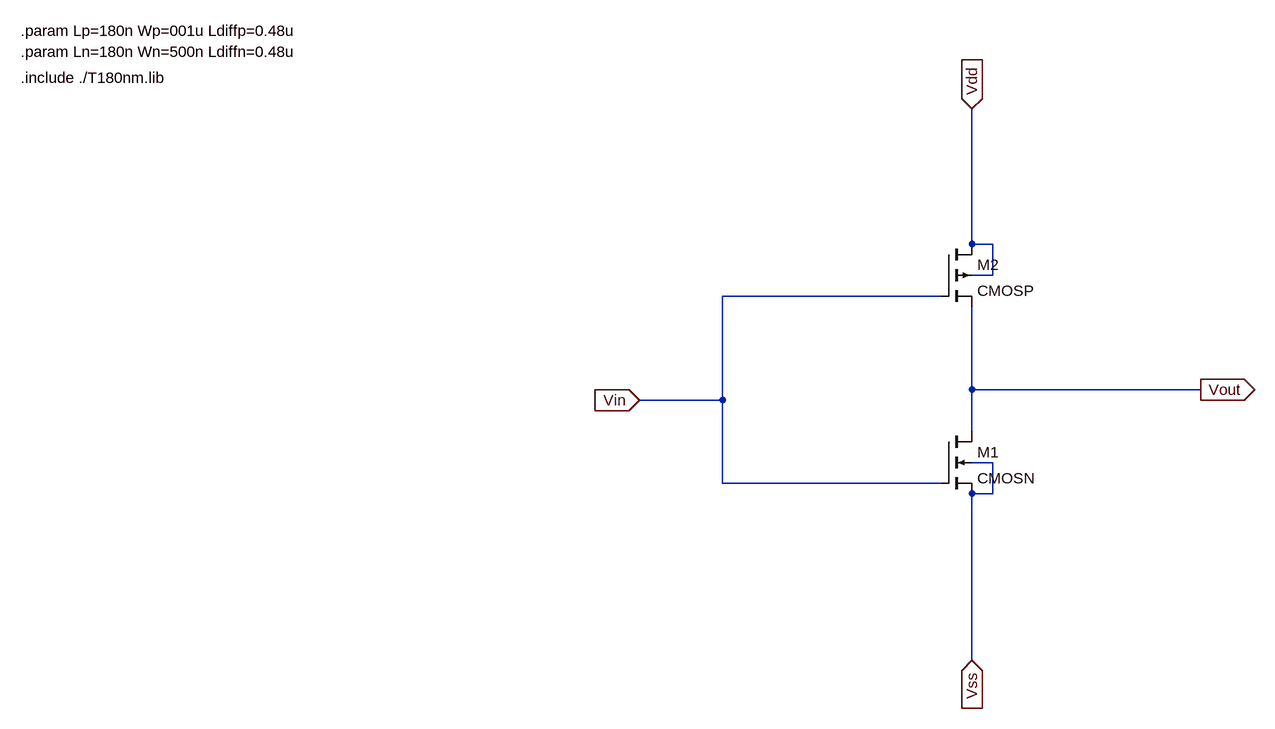
[diagram p0: schematic inversor.asc]
inversor.asc, the LTspice schematic file:
Version 4
SHEET 1 880 712
WIRE 224 -96 224 -304
WIRE 256 -96 224 -96
WIRE 256 -48 256 -96
WIRE 256 -48 224 -48
WIRE 176 -16 -160 -16
WIRE 224 128 224 0
WIRE 576 128 224 128
WIRE -160 144 -160 -16
WIRE -160 144 -288 144
WIRE 224 192 224 128
WIRE 256 240 224 240
WIRE -160 272 -160 144
WIRE 176 272 -160 272
WIRE 256 288 256 240
WIRE 256 288 224 288
WIRE 224 544 224 288
FLAG -288 144 Vin
IOPIN -288 144 In
FLAG 576 128 Vout
IOPIN 576 128 Out
FLAG 224 -304 Vdd
IOPIN 224 -304 In
FLAG 224 544 Vss
IOPIN 224 544 In
SYMBOL nmos4 176 192 R0
SYMATTR InstName M1
SYMATTR Value CMOSN
SYMATTR Value2 l={Ln} w={Wn} ad={Ldiffn*Wn} as={Ldiffn*Wn} pd={2*Ldiffn+Wn} ps={2*Ldiffn+Wn}
SYMBOL pmos4 176 -96 R0
SYMATTR InstName M2
SYMATTR Value CMOSP
SYMATTR Value2 l={Lp} w={Wp} ad={Ldiffp*Wp} as={Ldiffp*Wp} pd={2*Ldiffp+Wp} ps={2*Ldiffp+Wp}
TEXT -1240 -352 Left 2 !.include ./T180nm.lib
TEXT -1240 -424 Left 2 !.param Lp=180n Wp=001u Ldiffp=0.48u
TEXT -1240 -392 Left 2 !.param Ln=180n Wn=500n Ldiffn=0.48u

The netlist it stands for:
* inversor.asc
M1 Vout Vin Vss Vss CMOSN l={Ln} w={Wn} ad={Ldiffn*Wn} as={Ldiffn*Wn} pd={2*Ldiffn+Wn} ps={2*Ldiffn+Wn}
M2 Vdd Vin Vout Vdd CMOSP l={Lp} w={Wp} ad={Ldiffp*Wp} as={Ldiffp*Wp} pd={2*Ldiffp+Wp} ps={2*Ldiffp+Wp}
.model NMOS NMOS
.model PMOS PMOS
.lib standard.mos
.include ./T180nm.lib
.param Lp=180n Wp=001u Ldiffp=0.48u
.param Ln=180n Wn=500n Ldiffn=0.48u
.backanno
.end